# Altium project No_Opto_Flyback.PrjPcb
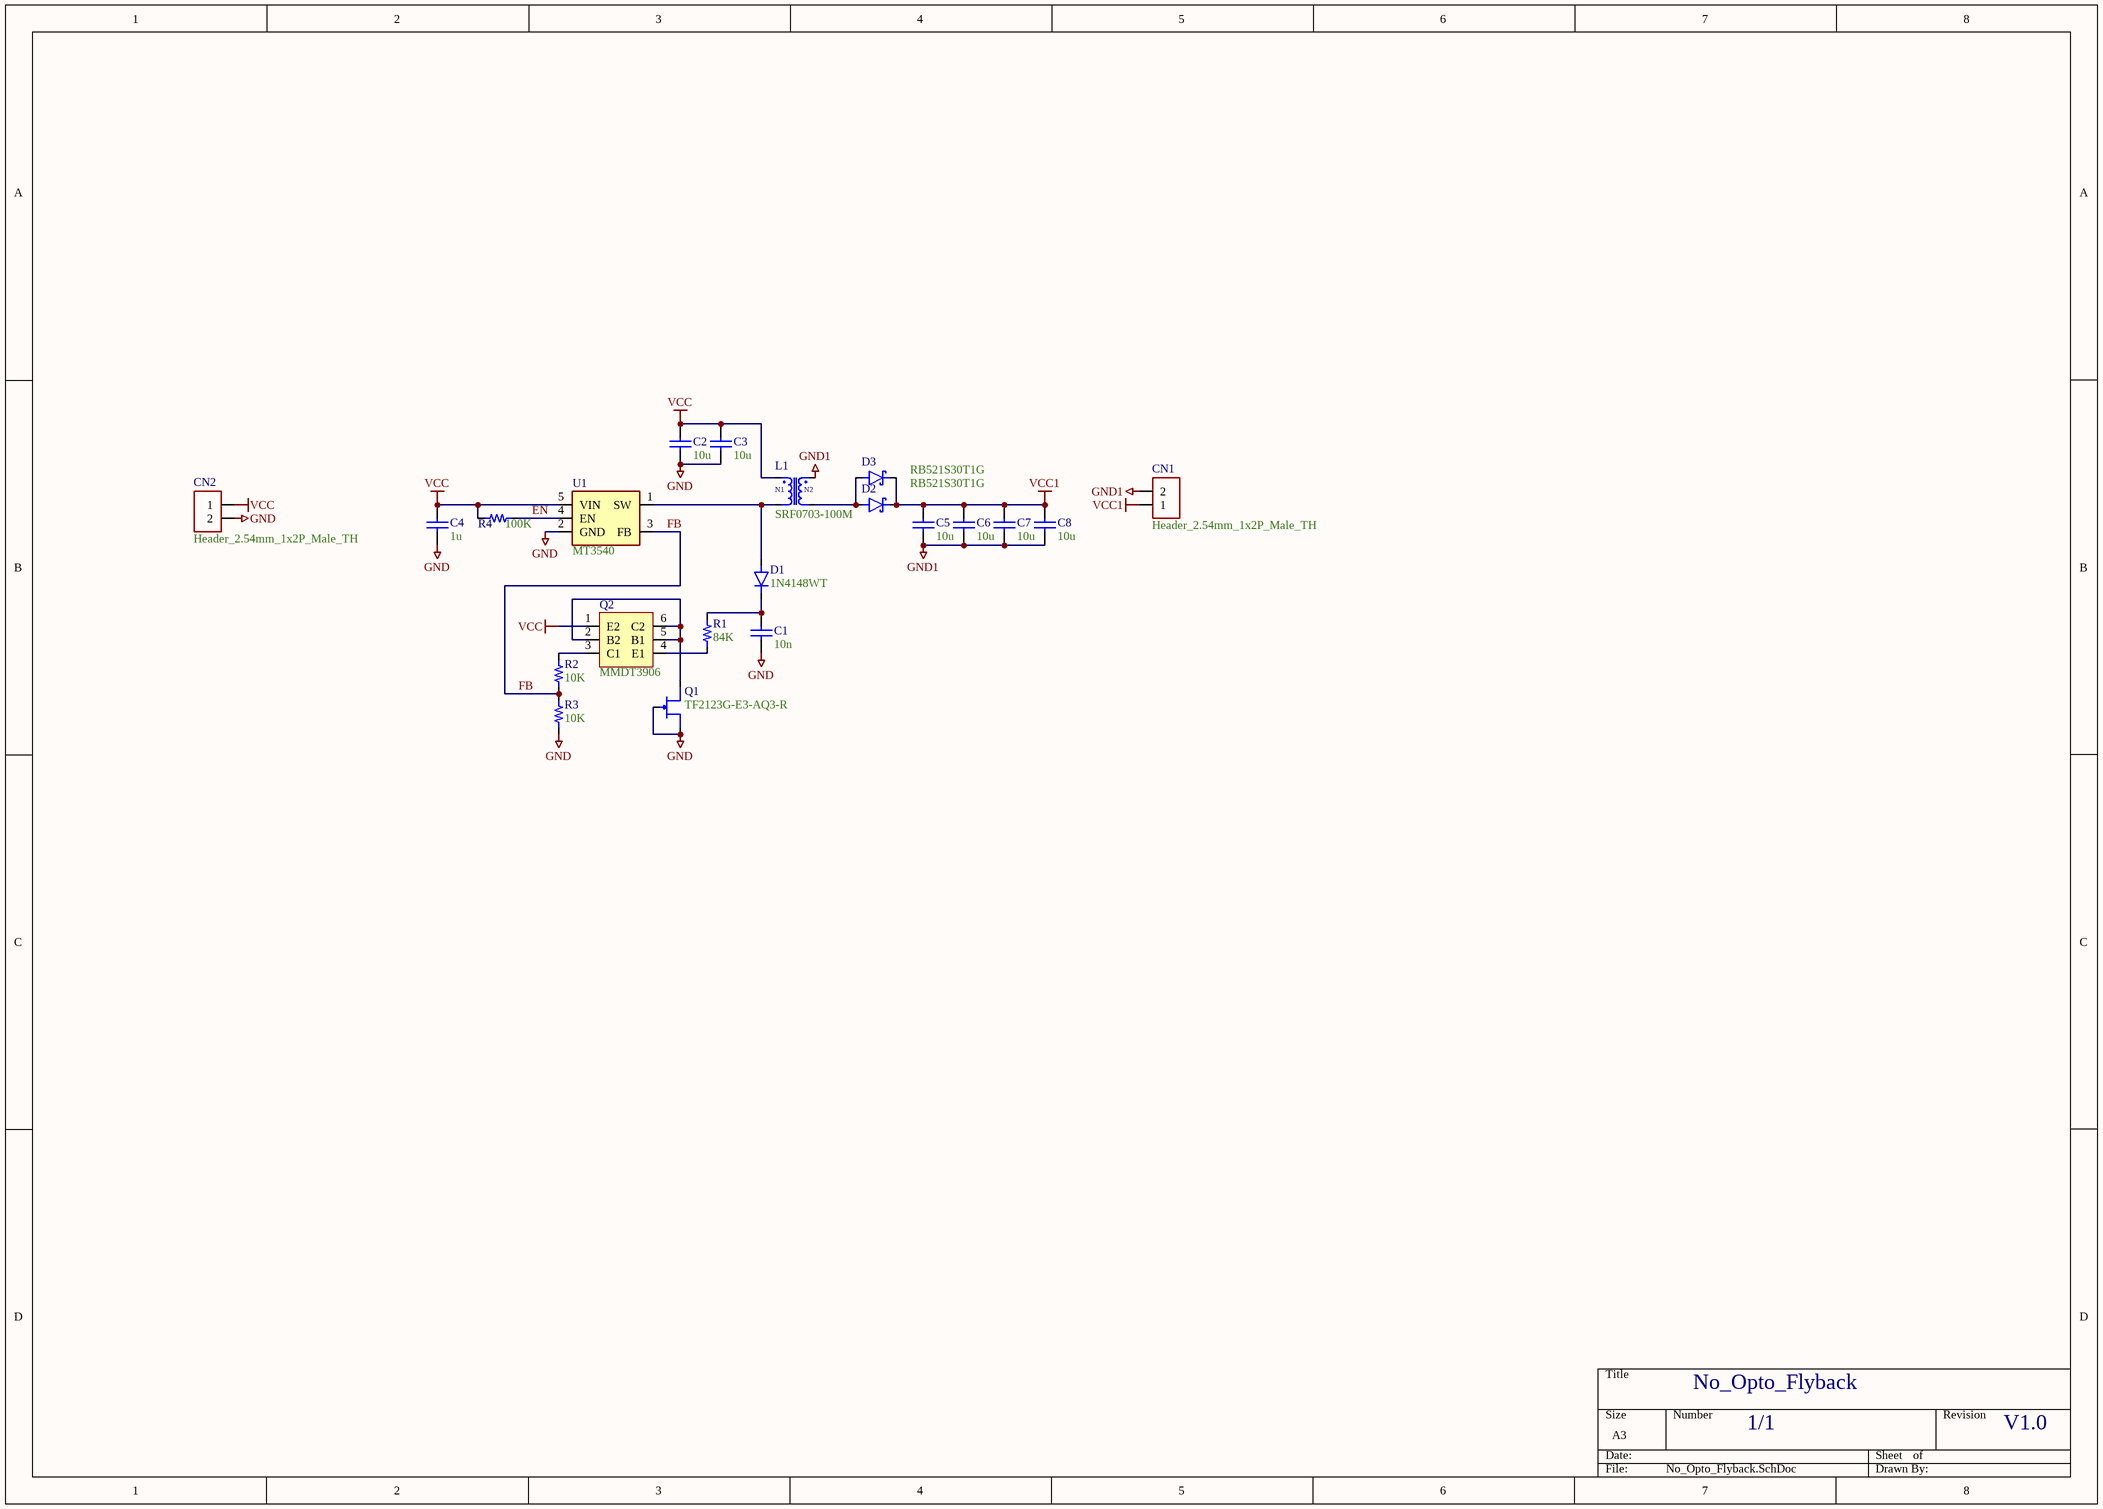
[diagram p0: No_Opto_Flyback.SchDoc]
1 sheet, 21 parts. Net scope: global (net labels, ports and power ports of the same name join across sheets).
Board file: No_Opto_Flyback.PcbDoc

## Sheet No_Opto_Flyback.SchDoc
size A3; SheetNumber: 1; SheetTotal: 1

### Parts
C1  10n  [CAP_0402]
C2  10u  [CAP_0603]
C3  10u  [CAP_0603]
C4  1u  [CAP_0402]
C5  10u  [CAP_0603]
C6  10u  [CAP_0603]
C7  10u  [CAP_0603]
C8  10u  [CAP_0603]
CN1  Header_2.54mm_1x2P_Male_TH  [Header_2.54mm_1x2P_Male_TH]
CN2  Header_2.54mm_1x2P_Male_TH  [Header_2.54mm_1x2P_Male_TH]
D1  1N4148WT  [SOD-523-2]
D2  RB521S30T1G  [SOD-523-2]
D3  RB521S30T1G  [SOD-523-2]
L1  SRF0703-100M  [SRF0703]
Q1  TF2123G-E3-AQ3-R  [SOT-723-3_120X80X50_40P]
Q2  MMDT3906  [SOT-363-6_215X130X110_65P]
R1  84K  [RES_0402]
R2  10K  [RES_0402]
R3  10K  [RES_0402]
R4  100K  [RES_0402]
U1  MT3540  [SOT-23-5_290X160X120_95P]

### Nets
GND: C1.2 C2.2 C3.2 C4.2 CN2.2 Q1.2(S) Q1.3(G) R3.1 U1.2(GND)
GND1: C5.2 C6.2 C7.2 C8.2 CN1.2 L1.2
VCC: C2.1 C3.1 C4.1 CN2.1 L1.1 Q2.1(E2) R4.2 U1.5(VIN)
VCC1: C5.1 C6.1 C7.1 C8.1 CN1.1 D2.1(K) D3.1(K)
EN: R4.1 U1.4(EN)
FB: R2.1 R3.2 U1.3(FB)
NetC1_1: C1.1 D1.1(K) R1.2
NetD1_2: D1.2(A) L1.3 U1.1(SW)
NetD2_2: D2.2(A) D3.2(A) L1.4
NetQ1_1: Q1.1(D) Q2.2(B2) Q2.5(B1) Q2.6(C2)
NetQ2_3: Q2.3(C1) R2.2
NetQ2_4: Q2.4(E1) R1.1

### Notes on the sheet
- No_Opto_Flyback
- 1/1
- V1.0
- (in symbol SRF0703-100M) N1; N2

### Library data of the parts
C1-C8 = Capacitor: Voltage: V
  C1: Value: 10n
  C2 C3 C5-C8: Value: 10u
  C4: Value: 1u
CN1 CN2 = Header_2.54mm_1x2P_Male_TH: Header_2.54mm_1x2P_Male / Through-hole; Value: Header_2.54mm_1x2P_Male_TH
D1 = 1N4148WT: Signal Diode; Value: 1N4148WT
D2 D3 = RB521S30T1G: Schottky Diode; Value: RB521S30T1G
L1 = SRF0703-100M: Current: A; Value: SRF0703-100M
Q1 = TF2123G-E3-AQ3-R: N-JFET; Value: TF2123G-E3-AQ3-R
Q2 = MMDT3906: Double PNP; Value: MMDT3906
R1-R4 = Resistor: Voltage: V
  R1: Value: 84K
  R2 R3: Value: 10K
  R4: Value: 100K
U1 = MT3540: Asynchronous Boost Convertor / Vin:2.5~5.5V / Vout:Vin~28V; Value: MT3540